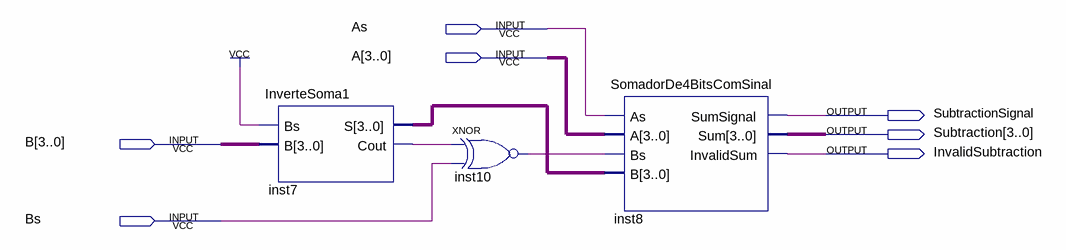
[diagram p0: schematic sheet]
// Quartus schematic SubtratorDe4BitsComSinal.bdf as structural Verilog: 3 symbols, 7 pins
module SubtratorDe4BitsComSinal (
  input  As,
  input  [3:0] A,
  input  [3:0] B,
  input  Bs,
  output SubtractionSignal,
  output [3:0] Subtraction,
  output InvalidSubtraction
);

  wire inst7_cout, inst10_out;
  wire [3:0] inst7_s;

  InverteSoma1 inst7 (.Bs(1'b1), .B(B), .S(inst7_s), .Cout(inst7_cout));
  xnor inst10 (inst10_out, inst7_cout, Bs);
  SomadorDe4BitsComSinal inst8 (
    .As(As), .A(A), .Bs(inst10_out), .B(inst7_s), .SumSignal(SubtractionSignal), .Sum(Subtraction),
    .InvalidSum(InvalidSubtraction));
endmodule
